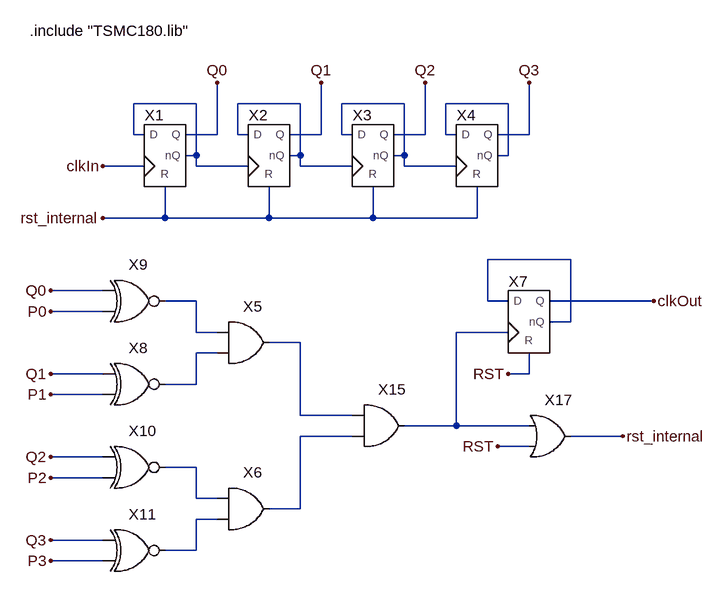
[diagram p0: schematic freq_divider_2n.asc]
freq_divider_2n.asc, the LTspice schematic file:
Version 4
SHEET 1 2908 1612
WIRE 1184 336 1088 336
WIRE 1344 336 1248 336
WIRE 1504 336 1408 336
WIRE 1664 336 1568 336
WIRE 1088 384 1088 336
WIRE 1104 384 1088 384
WIRE 1216 384 1216 304
WIRE 1216 384 1168 384
WIRE 1248 384 1248 336
WIRE 1264 384 1248 384
WIRE 1376 384 1376 304
WIRE 1376 384 1328 384
WIRE 1408 384 1408 336
WIRE 1424 384 1408 384
WIRE 1536 384 1536 304
WIRE 1536 384 1488 384
WIRE 1568 384 1568 336
WIRE 1584 384 1568 384
WIRE 1696 384 1696 304
WIRE 1696 384 1648 384
WIRE 1184 416 1184 336
WIRE 1184 416 1168 416
WIRE 1344 416 1344 336
WIRE 1344 416 1328 416
WIRE 1504 416 1504 336
WIRE 1504 416 1488 416
WIRE 1664 416 1664 336
WIRE 1664 416 1648 416
WIRE 1104 432 1040 432
WIRE 1184 432 1184 416
WIRE 1264 432 1184 432
WIRE 1344 432 1344 416
WIRE 1424 432 1344 432
WIRE 1504 432 1504 416
WIRE 1584 432 1504 432
WIRE 1136 512 1136 464
WIRE 1136 512 1040 512
WIRE 1296 512 1296 464
WIRE 1296 512 1136 512
WIRE 1456 512 1456 464
WIRE 1456 512 1296 512
WIRE 1616 512 1616 464
WIRE 1616 512 1456 512
WIRE 1760 576 1632 576
WIRE 1040 624 960 624
WIRE 1184 640 1136 640
WIRE 1632 640 1632 576
WIRE 1664 640 1632 640
WIRE 1888 640 1728 640
WIRE 1040 656 960 656
WIRE 1760 672 1760 576
WIRE 1760 672 1728 672
WIRE 1184 688 1184 640
WIRE 1216 688 1184 688
WIRE 1664 688 1584 688
WIRE 1344 704 1296 704
WIRE 1216 720 1184 720
WIRE 1040 752 960 752
WIRE 1696 752 1696 720
WIRE 1696 752 1664 752
WIRE 1184 768 1184 720
WIRE 1184 768 1136 768
WIRE 1040 784 960 784
WIRE 1344 816 1344 704
WIRE 1424 816 1344 816
WIRE 1584 832 1584 688
WIRE 1584 832 1504 832
WIRE 1696 832 1584 832
WIRE 1424 848 1344 848
WIRE 1840 848 1760 848
WIRE 1696 864 1648 864
WIRE 1040 880 960 880
WIRE 1184 896 1136 896
WIRE 1040 912 960 912
WIRE 1184 944 1184 896
WIRE 1216 944 1184 944
WIRE 1344 960 1344 848
WIRE 1344 960 1296 960
WIRE 1216 976 1184 976
WIRE 1040 1008 960 1008
WIRE 1184 1024 1184 976
WIRE 1184 1024 1136 1024
WIRE 1040 1040 960 1040
FLAG 1040 432 clkIn
FLAG 1216 304 Q0
FLAG 1376 304 Q1
FLAG 1536 304 Q2
FLAG 1696 304 Q3
FLAG 960 624 Q0
FLAG 960 752 Q1
FLAG 960 880 Q2
FLAG 960 1008 Q3
FLAG 960 656 P0
FLAG 960 784 P1
FLAG 960 912 P2
FLAG 960 1040 P3
FLAG 1040 512 rst_internal
FLAG 1648 864 RST
FLAG 1840 848 rst_internal
FLAG 1888 640 clkOut
FLAG 1664 752 RST
SYMBOL ffd_arst 1136 416 R0
SYMATTR InstName X1
SYMATTR SpiceLine VDD={VDD} L={L} LD={LD} WN={WN} WPFACT=1.5
SYMBOL ffd_arst 1296 416 R0
SYMATTR InstName X2
SYMATTR SpiceLine VDD={VDD} L={L} LD={LD} WN={WN} WPFACT=1.5
SYMBOL ffd_arst 1456 416 R0
SYMATTR InstName X3
SYMATTR SpiceLine VDD={VDD} L={L} LD={LD} WN={WN} WPFACT=1.5
SYMBOL ffd_arst 1616 416 R0
SYMATTR InstName X4
SYMATTR SpiceLine VDD={VDD} L={L} LD={LD} WN={WN} WPFACT=1.5
SYMBOL xnor 1088 576 R0
SYMATTR InstName X9
SYMATTR SpiceLine VDD={VDD} L_INV={L} LD={LD} WN_INV={WN} WPFACT={WPFACT} L_TG={L} W_TG={WN}
SYMBOL and 1472 768 R0
SYMATTR InstName X15
SYMATTR SpiceLine VDD={VDD} L={L} LD={LD} WN={WN} WPFACT={WPFACT}
SYMBOL xnor 1088 704 R0
SYMATTR InstName X8
SYMATTR SpiceLine VDD={VDD} L_INV={L} LD={LD} WN_INV={WN} WPFACT={WPFACT} L_TG={L} W_TG={WN}
SYMBOL xnor 1088 832 R0
SYMATTR InstName X10
SYMATTR SpiceLine VDD={VDD} L_INV={L} LD={LD} WN_INV={WN} WPFACT={WPFACT} L_TG={L} W_TG={WN}
SYMBOL xnor 1088 960 R0
SYMATTR InstName X11
SYMATTR SpiceLine VDD={VDD} L_INV={L} LD={LD} WN_INV={WN} WPFACT={WPFACT} L_TG={L} W_TG={WN}
SYMBOL or 1728 784 R0
SYMATTR InstName X17
SYMBOL and 1264 640 R0
SYMATTR InstName X5
SYMATTR SpiceLine VDD={VDD} L={L} LD={LD} WN={WN} WPFACT={WPFACT}
SYMBOL and 1264 896 R0
SYMATTR InstName X6
SYMATTR SpiceLine VDD={VDD} L={L} LD={LD} WN={WN} WPFACT={WPFACT}
SYMBOL ffd_arst 1696 672 R0
SYMATTR InstName X7
SYMATTR SpiceLine VDD={VDD} L={L} LD={LD} WN={WN} WPFACT=1.5
TEXT 928 224 Left 2 !.include "TSMC180.lib"

The netlist it stands for:
* freq_divider_2n.asc
XX1 N001 Q0 clkIn rst_internal N001 ffd_arst VDD={VDD} L={L} LD={LD} WN={WN} WPFACT=1.5  ; pins D Q CLK R nQ
XX2 N002 Q1 N001 rst_internal N002 ffd_arst VDD={VDD} L={L} LD={LD} WN={WN} WPFACT=1.5  ; pins D Q CLK R nQ
XX3 N003 Q2 N002 rst_internal N003 ffd_arst VDD={VDD} L={L} LD={LD} WN={WN} WPFACT=1.5  ; pins D Q CLK R nQ
XX4 N004 Q3 N003 rst_internal N004 ffd_arst VDD={VDD} L={L} LD={LD} WN={WN} WPFACT=1.5  ; pins D Q CLK R nQ
XX9 Q0 P0 N006 xnor VDD={VDD} L_INV={L} LD={LD} WN_INV={WN} WPFACT={WPFACT} L_TG={L} W_TG={WN}  ; pins A B OUT
XX15 N008 N010 N007 and VDD={VDD} L={L} LD={LD} WN={WN} WPFACT={WPFACT}  ; pins A B OUT
XX8 Q1 P1 N009 xnor VDD={VDD} L_INV={L} LD={LD} WN_INV={WN} WPFACT={WPFACT} L_TG={L} W_TG={WN}  ; pins A B OUT
XX10 Q2 P2 N011 xnor VDD={VDD} L_INV={L} LD={LD} WN_INV={WN} WPFACT={WPFACT} L_TG={L} W_TG={WN}  ; pins A B OUT
XX11 Q3 P3 N012 xnor VDD={VDD} L_INV={L} LD={LD} WN_INV={WN} WPFACT={WPFACT} L_TG={L} W_TG={WN}  ; pins A B OUT
XX17 N007 RST rst_internal or VDD=1.8 L=0.18u LD=0.48u WN=0.42u WPFACT=1.5  ; pins A B OUT
XX5 N006 N009 N008 and VDD={VDD} L={L} LD={LD} WN={WN} WPFACT={WPFACT}  ; pins A B OUT
XX6 N011 N012 N010 and VDD={VDD} L={L} LD={LD} WN={WN} WPFACT={WPFACT}  ; pins A B OUT
XX7 N005 clkOut N007 RST N005 ffd_arst VDD={VDD} L={L} LD={LD} WN={WN} WPFACT=1.5  ; pins D Q CLK R nQ
.include "TSMC180.lib"
.backanno
.end